# EAGLE schematic FIFO+Expander-Rev2 (EAGLE 9.6.2)

## Sheet 1 of 2
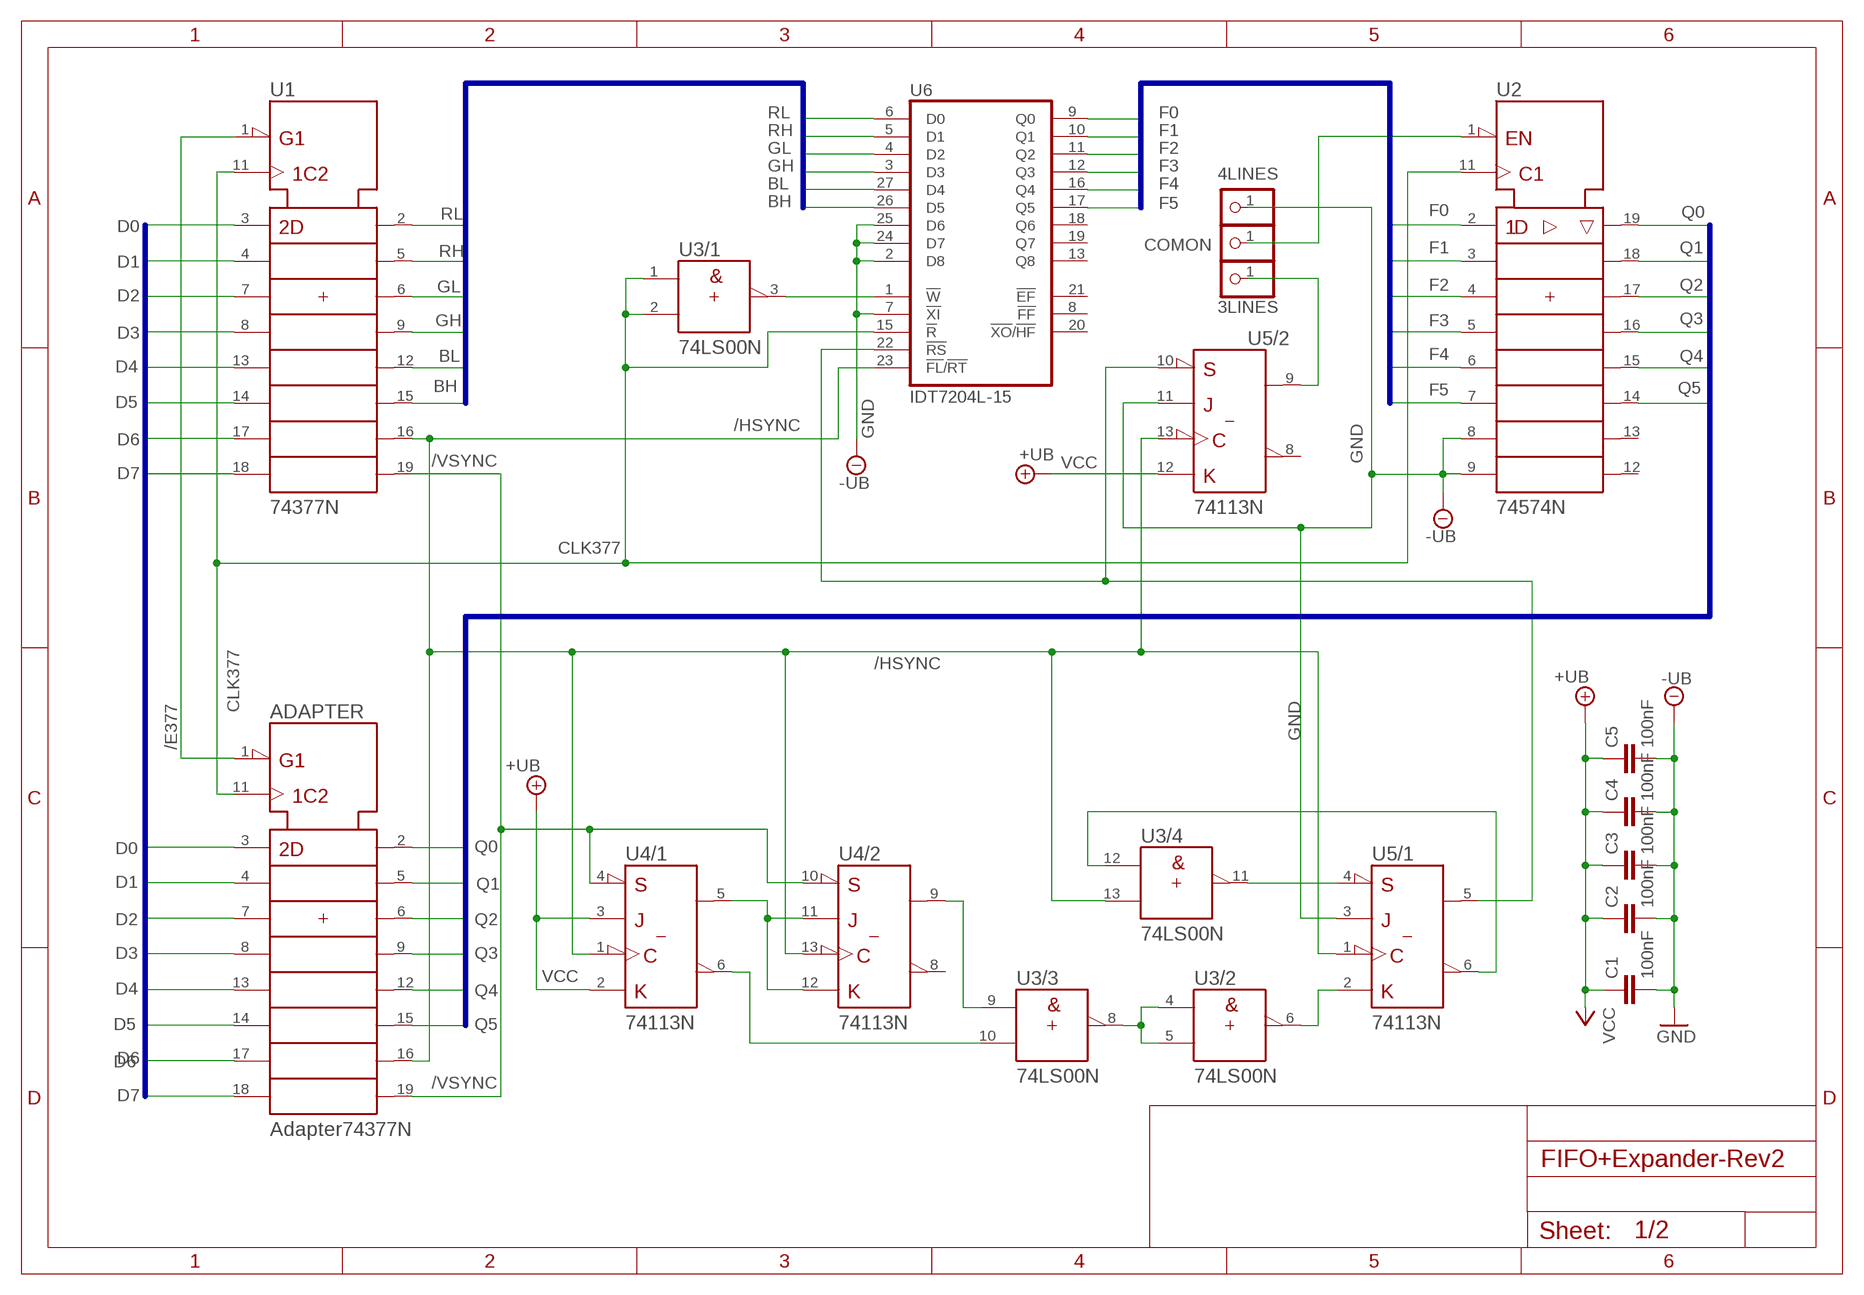
[diagram p0: schematic, sheet 1]

### Parts
3LINES  PINHD-1X1  [1X01]
4LINES  PINHD-1X1  [1X01]
ADAPTER  Adapter74377N  74377N  [DIL20]
C1  100nF  C5/2.5  [C5B2.5]
C2  100nF  C5/2.5  [C5B2.5]
C3  100nF  C5/2.5  [C5B2.5]
C4  100nF  C5/2.5  [C5B2.5]
C5  100nF  C5/2.5  [C5B2.5]
COMON  PINHD-1X1  [1X01]
U1  74377N  [DIL20]
U2  74574N  [DIL20]
U3  74LS00N  [DIL14]
U4  74113N  [DIL14]
U5  74113N  [DIL14]
U6  IDT7204L-15  7203PDIL28-3  [DIL28-3]

### Nets
/E377: ADAPTER.1(!G) U1.1(!G)
/HSYNC: ADAPTER.16(7Q) U1.16(7Q) U3.13(/4:B) U4.1(/1:CLK) U4.13(/2:CLK) U5.1(/1:CLK) U5.13(/2:CLK) U6.23(!FL!/!RT)
/VSYNC: ADAPTER.19(8Q) U1.19(8Q) U4.4(/1:!PRE) U4.10(/2:!PRE)
BH: U1.15(6Q) U6.26(D5)
BL: U1.12(5Q) U6.27(D4)
CLK377: ADAPTER.11(CLK) U1.11(CLK) U2.11(CLK) U3.1(/1:A) U3.2(/1:B) U6.15(!R)
D0: ADAPTER.3(1D) U1.3(1D)
D1: ADAPTER.4(2D) U1.4(2D)
D2: ADAPTER.7(3D) U1.7(3D)
D3: ADAPTER.8(4D) U1.8(4D)
D4: ADAPTER.13(5D) U1.13(5D)
D5: ADAPTER.14(6D) U1.14(6D)
D6: ADAPTER.17(7D) U1.17(7D)
D7: ADAPTER.18(8D) U1.18(8D)
F0: U2.2(1D) U6.9(Q0)
F1: U2.3(2D) U6.10(Q1)
F2: U2.4(3D) U6.11(Q2)
F3: U2.5(4D) U6.12(Q3)
F4: U2.6(5D) U6.16(Q4)
F5: U2.7(6D) U6.17(Q5)
GH: U1.9(4Q) U6.3(D3)
GL: U1.6(3Q) U6.4(D2)
GND [power]: 4LINES.1 C1.2 C2.2 C3.2 C4.2 C5.2 U2.8(7D) U2.9(8D) U5.3(/1:J) U5.11(/2:J) U6.2(D8) U6.7(!XI) U6.24(D7) U6.25(D6) ; supply symbol labelled -UB ; also sheet 2
N$1: U4.5(/1:Q) U4.11(/2:J) U4.12(/2:K)
N$2: U3.3(/1:Y) U6.1(!W)
N$3: U3.10(/3:B) U4.6(/1:!Q)
N$4: U3.9(/3:A) U4.9(/2:Q)
N$6: U3.4(/2:A) U3.5(/2:B) U3.8(/3:Y)
N$7: U3.6(/2:Y) U5.2(/1:K)
N$8: U3.11(/4:Y) U5.4(/1:!PRE)
N$9: U3.12(/4:A) U5.6(/1:!Q)
N$10: 3LINES.1 U5.9(/2:Q)
N$11: COMON.1 U2.1(!OC)
N$12: U5.5(/1:Q) U5.10(/2:!PRE) U6.22(!RS)
Q0: ADAPTER.2(1Q) U2.19(1Q)
Q1: ADAPTER.5(2Q) U2.18(2Q)
Q2: ADAPTER.6(3Q) U2.17(3Q)
Q3: ADAPTER.9(4Q) U2.16(4Q)
Q4: ADAPTER.12(5Q) U2.15(5Q)
Q5: ADAPTER.15(6Q) U2.14(6Q)
RH: U1.5(2Q) U6.5(D1)
RL: U1.2(1Q) U6.6(D0)
VCC [power]: C1.1 C2.1 C3.1 C4.1 C5.1 U4.2(/1:K) U4.3(/1:J) U5.12(/2:K) ; supply symbol labelled +UB ; also sheet 2
Unconnected: U2.12(8Q) U2.13(7Q) U4.8(/2:!Q) U5.8(/2:!Q) U6.8(!FF) U6.13(Q8) U6.18(Q6) U6.19(Q7) U6.20(!XO!/!HF) U6.21(!EF)

### Buses
D0,D1,D2,D3,D4,D5,D6,D7
BH,BL,GH,GL,RH,RL
F0,F1,F2,F3,F4,F5
Q0,Q1,Q2,Q3,Q4,Q5

## Sheet 2 of 2
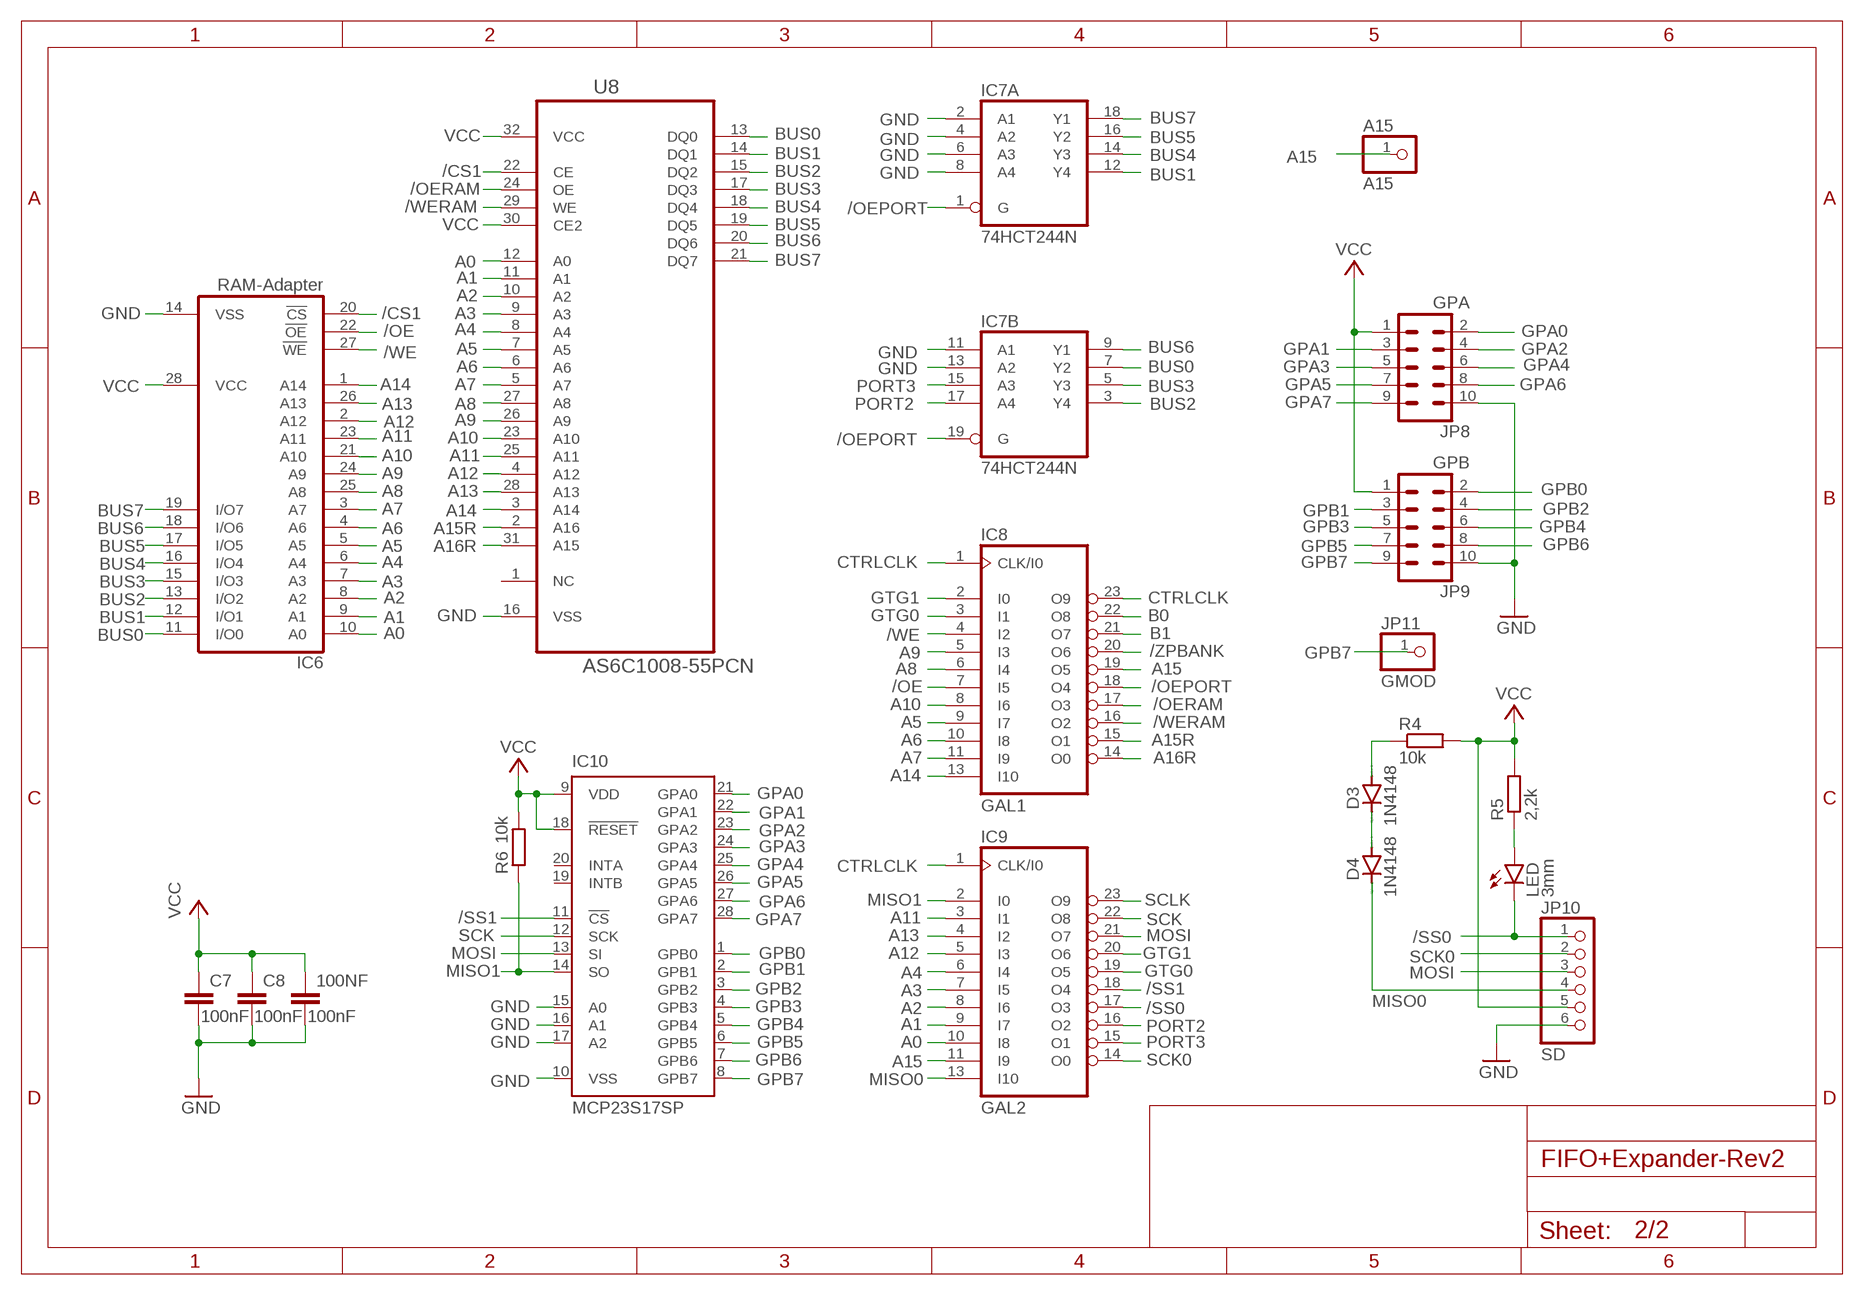
[diagram p1: schematic, sheet 2]

### Parts
100NF  100nF  C5/2.5  [C5B2.5]
A15  A15  PINHD-1X1  [1X01]
C7  100nF  C5/2.5  [C5B2.5]
C8  100nF  C5/2.5  [C5B2.5]
D3  1N4148  1N4148DO35-7  [DO35-7]
D4  1N4148  1N4148DO35-7  [DO35-7]
IC6  RAM-Adapter  62256P  [DIL28-6]
IC7  74HCT244N  [DIL20]
IC8  GAL1  22V10  [DIL24-3]
IC9  GAL2  22V10  [DIL24-3]
IC10  MCP23S17SP  [DIL28-3]
JP8  GPA  ML10  [ML10]
JP9  GPB  ML10  [ML10]
JP10  SD  PINHD-1X6  [1X06]
JP11  GMOD  PINHD-1X1  [1X01]
LED  3mm  LED3MM  [LED3MM]
R4  10k  R-EU_0207/10  [0207/10]
R5  2,2k  R-EU_0207/10  [0207/10]
R6  10k  R-EU_0207/10  [0207/10]
U8  AS6C1008-55PCN  [DIP254P1524X393-32]

### Nets
/CS1: IC6.20(!CS) U8.22(CE)
/OE: IC6.22(!OE) IC8.7(I5)
/OEPORT: IC7.1(A:G) IC7.19(B:G) IC8.18(O4)
/OERAM: IC8.17(O3) U8.24(OE)
/SS0: IC9.17(O3) JP10.1 LED.K(C)
/SS1: IC9.18(O4) IC10.11(!CS)
/WE: IC6.27(!WE) IC8.4(I2)
/WERAM: IC8.16(O2) U8.29(WE)
/ZPBANK: IC8.20(O6)
A0: IC6.10(A0) IC9.10(I8) U8.12(A0)
A1: IC6.9(A1) IC9.9(I7) U8.11(A1)
A2: IC6.8(A2) IC9.8(I6) U8.10(A2)
A3: IC6.7(A3) IC9.7(I5) U8.9(A3)
A4: IC6.6(A4) IC9.6(I4) U8.8(A4)
A5: IC6.5(A5) IC8.9(I7) U8.7(A5)
A6: IC6.4(A6) IC8.10(I8) U8.6(A6)
A7: IC6.3(A7) IC8.11(I9) U8.5(A7)
A8: IC6.25(A8) IC8.6(I4) U8.27(A8)
A9: IC6.24(A9) IC8.5(I3) U8.26(A9)
A10: IC6.21(A10) IC8.8(I6) U8.23(A10)
A11: IC6.23(A11) IC9.3(I1) U8.25(A11)
A12: IC6.2(A12) IC9.5(I3) U8.4(A12)
A13: IC6.26(A13) IC9.4(I2) U8.28(A13)
A14: IC6.1(A14) IC8.13(I10) U8.3(A14)
A15: A15.1 IC8.19(O5) IC9.11(I9)
A15R: IC8.15(O1) U8.2(A16)
A16R: IC8.14(O0) U8.31(A15)
B0: IC8.22(O8)
B1: IC8.21(O7)
BUS0: IC6.11(I/O0) IC7.7(B:Y2) U8.13(DQ0)
BUS1: IC6.12(I/O1) IC7.12(A:Y4) U8.14(DQ1)
BUS2: IC6.13(I/O2) IC7.3(B:Y4) U8.15(DQ2)
BUS3: IC6.15(I/O3) IC7.5(B:Y3) U8.17(DQ3)
BUS4: IC6.16(I/O4) IC7.14(A:Y3) U8.18(DQ4)
BUS5: IC6.17(I/O5) IC7.16(A:Y2) U8.19(DQ5)
BUS6: IC6.18(I/O6) IC7.9(B:Y1) U8.20(DQ6)
BUS7: IC6.19(I/O7) IC7.18(A:Y1) U8.21(DQ7)
CTRLCLK: IC8.1(CLK/I0) IC8.23(O9) IC9.1(CLK/I0)
GND [power]: 100NF.2 C7.2 C8.2 IC6.14(VSS) IC7.2(A:A1) IC7.4(A:A2) IC7.6(A:A3) IC7.8(A:A4) IC7.11(B:A1) IC7.13(B:A2) IC10.10(VSS) IC10.15(A0) IC10.16(A1) IC10.17(A2) JP8.10 JP9.10 JP10.6 U8.16(VSS) ; also sheet 1
GPA0: IC10.21(GPA0) JP8.2
GPA1: IC10.22(GPA1) JP8.3
GPA2: IC10.23(GPA2) JP8.4
GPA3: IC10.24(GPA3) JP8.5
GPA4: IC10.25(GPA4) JP8.6
GPA5: IC10.26(GPA5) JP8.7
GPA6: IC10.27(GPA6) JP8.8
GPA7: IC10.28(GPA7) JP8.9
GPB0: IC10.1(GPB0) JP9.2
GPB1: IC10.2(GPB1) JP9.3
GPB2: IC10.3(GPB2) JP9.4
GPB3: IC10.4(GPB3) JP9.5
GPB4: IC10.5(GPB4) JP9.6
GPB5: IC10.6(GPB5) JP9.7
GPB6: IC10.7(GPB6) JP9.8
GPB7: IC10.8(GPB7) JP9.9 JP11.1
GTG0: IC8.3(I1) IC9.19(O5)
GTG1: IC8.2(I0) IC9.20(O6)
MISO0: D4.C IC9.13(I10) JP10.4
MISO1: IC9.2(I0) IC10.14(SO) R6.1
MOSI: IC9.21(O7) IC10.13(SI) JP10.3
N$5: D3.C D4.A
N$13: LED.A R5.1
N$14: D3.A R4.1
PORT2: IC7.17(B:A4) IC9.16(O2)
PORT3: IC7.15(B:A3) IC9.15(O1)
SCK: IC9.22(O8) IC10.12(SCK)
SCK0: IC9.14(O0) JP10.2
SCLK: IC9.23(O9)
VCC [power]: 100NF.1 C7.1 C8.1 IC6.28(VCC) IC10.9(VDD) IC10.18(!RESET) JP8.1 JP9.1 JP10.5 R4.2 R5.2 R6.2 U8.30(CE2) U8.32(VCC) ; also sheet 1
Unconnected: IC10.19(INTB) IC10.20(INTA) U8.1(NC)

## Power pins joined to a net without a drawn wire
+UB: ADAPTER.20(+UB) U1.20(+UB) U2.20(+UB) U3.14(/+UB:+UB) U4.14(/+UB:+UB) U5.14(/+UB:+UB)
-UB: ADAPTER.10(-UB) U1.10(-UB) U2.10(-UB) U3.7(/-UB:-UB) U4.7(/-UB:-UB) U5.7(/-UB:-UB)
GND: IC7.10(P:GND) IC8.12(GND) IC9.12(GND) U6.14(GND)
VCC: IC7.20(P:VCC) IC8.24(VCC) IC9.24(VCC) U6.28(VCC)

## Library data of the parts
3LINES 4LINES A15 COMON JP11 = pinhead:PINHD-1X1: PIN HEADER
100NF C1-C5 C7 C8 = capacitor-wima:C: CAPACITOR naming: grid - package width
ADAPTER U1 = 74ttl-din:74*377: Octal D type FLIP FLOP, enable
D3 D4 = diode:1N4148: DIODE high speed (Philips)
IC6 = memory-hitachi:62256P: MEMORY; OC_FARNELL: unknown; OC_NEWARK: unknown
IC7 = 74xx-eu:74*244: Octal BUFFER and LINE DRIVER, 3-state
IC8 IC9 = pal:22V10: PAL; MPN: GAL22V10D-7LPN; OC_FARNELL: 1571925; OC_NEWARK: 97M0480
IC10 = microchip:MCP23S17: http://ww1.microchip.com/downloads/en/DeviceDoc/21952a.pdf Source: http://ww1.microchip.com/downloads/en/DeviceDoc/21952a.pdf; MF: MICROCHIP; MPN: MCP23S17-E/SP; OC_FARNELL: 1292238; OC_NEWARK: 31K2951
JP8 JP9 = con-ml:ML10: HARTING; OC_FARNELL: unknown; OC_NEWARK: unknown
JP10 = pinhead:PINHD-1X6: PIN HEADER
LED = led:LED: LED OSRAM: - CHIPLED LG R971, LG N971, LY N971, LG Q971, LY Q971, LO R971, LY R971 LH N974, LH R974 LS Q976, LO Q976, LY Q976 LO Q996 - Hyper CHIPLED LW Q18S LB Q993, LB Q99A, LB R99A - SideLED LS A670, LO A670, LY A670, LG A670, LP A670 LB A673, LV A673, LT A673, LW A673 LH A674 LY A675 LS A676, LA A676, LO A676, LY A676, LW A676 LS A679, LY A679, LG A679 - Hyper Micro SIDELED® LS Y876, LA Y876, LO Y876, LY Y876 LT Y87S - SmartLED LW L88C, LW L88S LB L89C, LB L89S, LG L890 LS L89K, LO L89K, LY L89K LS L896, LA L896, LO L896, LY L896 - TOPLED LS T670, LO T670, LY T670, LG T670, LP T670 LSG T670, LSP T670, LSY T670, LOP T670, LYG T670 LG T671, LOG T671, LSG T671 LB T673, LV T673, LT T673, LW T673 LH T674 LS T676, LA T676, LO T676, LY T676, LB T676, LH T676, LSB T676, LW T676 LB T67C, LV T67C, LT T67C, LS T67K, LO T67K, LY T67K, LW E67C LS E67B, LA E67B, LO E67B, LY E67B, LB E67C, LV E67C, LT E67C LW T67C LS T679, LY T679, LG T679 LS T770, LO T770, LY T770, LG T770, LP T770 LB T773, LV T773, LT T773, LW T773 LH T774 LS E675, LA E675, LY E675, LS T675 LS T776, LA T776, LO T776, LY T776, LB T776 LHGB T686 LT T68C, LB T68C - Hyper Mini TOPLED® LB M676 - Mini TOPLED Santana® LG M470 LS M47K, LO M47K, LY M47K Source: http://www.osram.convergy.de LUXEON: - LUMILED® LXK2-PW12-R00, LXK2-PW12-S00, LXK2-PW14-U00, LXK2-PW14-V00 LXK2-PM12-R00, LXK2-PM12-S00, LXK2-PM14-U00 LXK2-PE12-Q00, LXK2-PE12-R00, LXK2-PE12-S00, LXK2-PE14-T00, LXK2-PE14-U00 LXK2-PB12-K00, LXK2-PB12-L00, LXK2-PB12-M00, LXK2-PB14-N00, LXK2-PB14-P00, LXK2-PB14-Q00 LXK2-PR12-L00, LXK2-PR12-M00, LXK2-PR14-Q00, LXK2-PR14-R00 LXK2-PD12-Q00, LXK2-PD12-R00, LXK2-PD12-S00 LXK2-PH12-R00, LXK2-PH12-S00 LXK2-PL12-P00, LXK2-PL12-Q00, LXK2-PL12-R00 Source: www.luxeon.com KINGBRIGHT: KA-3528ASYC Source: www.kingbright.com
R4-R6 = rcl:R-EU_: RESISTOR, European symbol; SPICEPREFIX: R
U2 = 74ttl-din:74*574: 8-bit D type FLIP FLOP bus driver
U3 = 74ttl-din:74*00: Quad 2-input NAND gate
U4 U5 = 74ttl-din:74*113: Dual J-K negative edge triggered FLIP FLOP, preset
U6 = memory-idt:7203P: MEMORY
U8 = Alliance_Memory_By_element14_Batch_1:AS6C1008-55PCN: CMOS SRAM; MPN: AS6C1008-55PCN; OC_FARNELL: 1562896; OC_NEWARK: 94M6214; PACKAGE: DIP-32; SUPPLIER: ALLIANCE MEMORY

## Net classes
0 default: width 0.152 mm, drill 0.127 mm, clearance 0.127 mm
1 power: width 0.203 mm, drill 0.127 mm, clearance 0.127 mm